# EasyEDA schematic EasyEDA_Schematic_V2.0.json
TITLE: Analog Safety Signal v2; REV: 1.0; Date: 2023-09-03; Sheet: 1/1; Drawn By: DJL19229
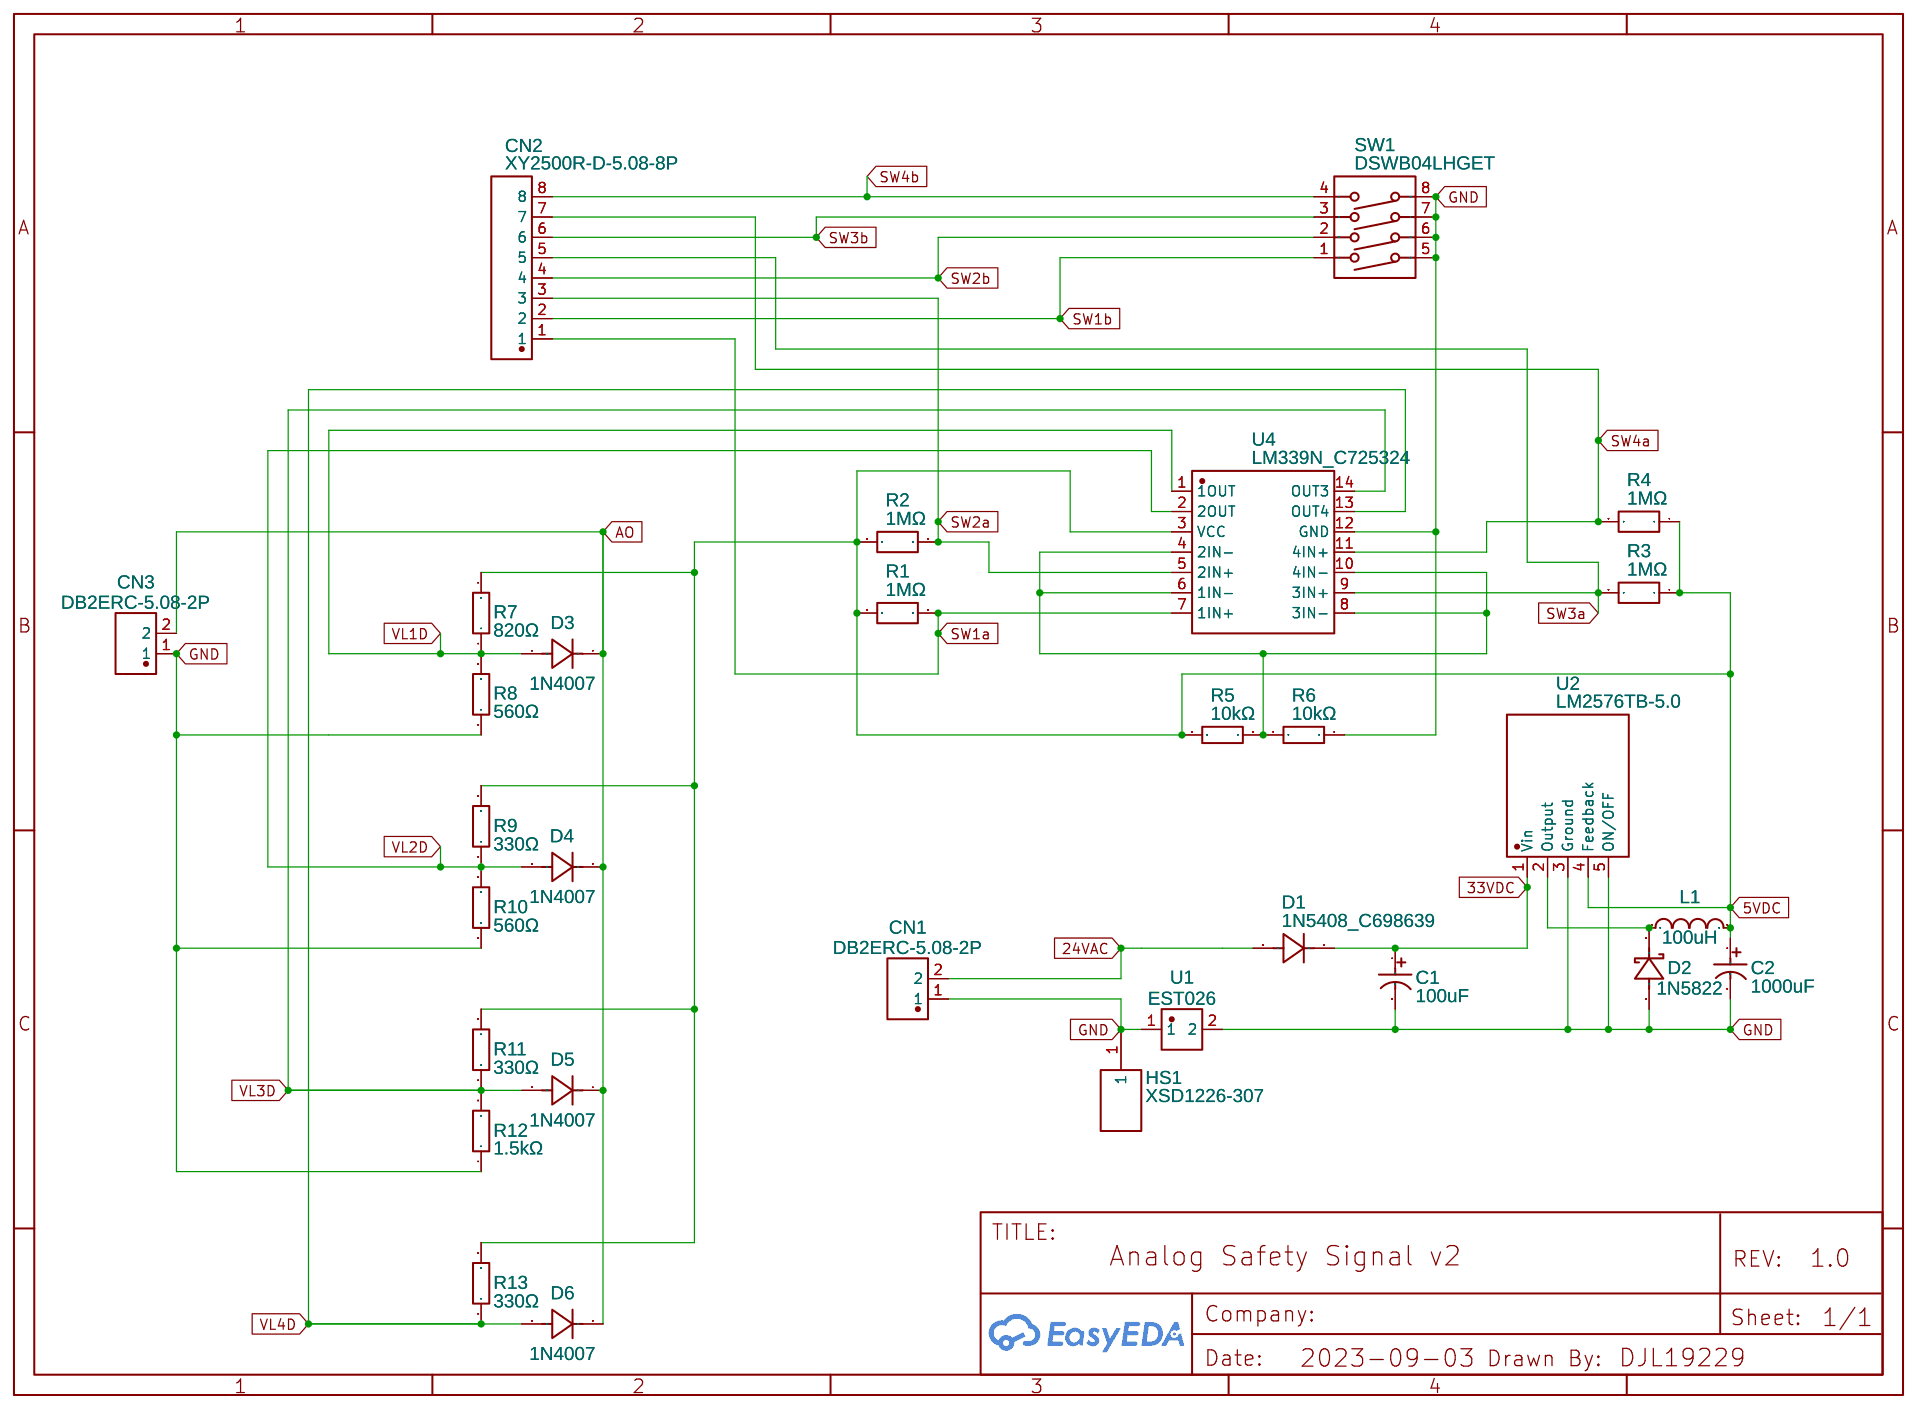
[diagram p0: schematic sheet]

## Parts
C1  100uF  [CAP-TH_BD8.0-P3.50-D0.6-FD]
C2  1000uF  [CAP-TH_BD13.0-P5.00-D1.2-FD]
CN1  DB2ERC-5.08-2P  [CONN-TH_2P-P5.08_DB2ERC-5.08-2P]
CN2  XY2500R-D-5.08-8P  [CONN-TH_8P-P5.08_XY2500R-D5.08-8P]
CN3  DB2ERC-5.08-2P  [CONN-TH_2P-P5.08_DB2ERC-5.08-2P]
D1  1N5408_C698639  [DO-201AD_BD5.3-L8.4-P12.50-D1.4-RD]
D2  1N5822  [DO-201AD_BD5.3-L8.4-P12.50-D1.4-FD]
D3  1N4007  [DO-41_BD2.4-L4.7-P8.70-D0.6-RD]
D4  1N4007  [DO-41_BD2.4-L4.7-P8.70-D0.6-RD]
D5  1N4007  [DO-41_BD2.4-L4.7-P8.70-D0.6-RD]
D6  1N4007  [DO-41_BD2.4-L4.7-P8.70-D0.6-RD]
HS1  XSD1226-307  [HEATSINK-TH_XSD1226-307]
L1  100uH  [IND-TH_BD10.0-P5.00-D0.7]
R1  1MΩ  [RES-TH_BD2.3-L6.5-P10.50-D0.5]
R2  1MΩ  [RES-TH_BD2.3-L6.5-P10.50-D0.5]
R3  1MΩ  [RES-TH_BD2.3-L6.5-P10.50-D0.5]
R4  1MΩ  [RES-TH_BD2.3-L6.5-P10.50-D0.5]
R5  10kΩ  [RES-TH_BD2.3-L6.5-P10.50-D0.5]
R6  10kΩ  [RES-TH_BD2.3-L6.5-P10.50-D0.5]
R7  820Ω  [RES-TH_BD2.2-L6.5-P10.50-D0.6]
R8  560Ω  [RES-TH_BD2.4-L6.3-P10.30-D0.6]
R9  330Ω  [RES-TH_BD2.4-L6.3-P10.30-D0.6]
R10  560Ω  [RES-TH_BD2.4-L6.3-P10.30-D0.6]
R11  330Ω  [RES-TH_BD2.4-L6.3-P10.30-D0.6]
R12  1.5kΩ  [RES-TH_BD2.3-L6.5-P10.50-D0.5]
R13  330Ω  [RES-TH_BD2.4-L6.3-P10.30-D0.6]
SW1  DSWB04LHGET  [SW-TH_DSWB04LHGET]
U1  EST026  [CONN-TH_L6.3-W0.8-EST026]
U2  LM2576TB-5.0  [TO-220-5_L10.2-W4.8-P1.70-TL]
U4  LM339N_C725324  [DIP-14_L19.0-W7.0-P2.54-LS7.6-BL]

## Library data of the parts
C1 = 100uF 50V 8*12Black high frequency: Supplier: LCSC; Manufacturer: CX(承兴); Manufacturer Part: GR107M050F12RR0VH4FP0; Supplier Part: C45102; JLCPCB Part Class: Extended Part
C2 = 35YXJ1000M12.5X20: Supplier: LCSC; Manufacturer: rubycon(红宝石); Supplier Part: C88743; JLCPCB Part Class: Extended Part
CN1 CN3 = DB2ERC-5.08-2P: Supplier: LCSC; Supplier Part: C395737; Manufacturer: DIBO(地博电气); Manufacturer Part: DB2ERC-5.08-2P-GN; Contributor: LCSC; JLCPCB Part Class: Extended Part
CN2 = XY2500R-D-5.08-8P: Contributor: LCSC; Supplier: LCSC; Supplier Part: C505830; Manufacturer: XINLAIYA(新莱亚); JLCPCB Part Class: Extended Part; link: https://lcsc.com/eda_search?q=C505830&%26type=1&ref=editor
D1 = 1N5408_C698639: Supplier: LCSC; Supplier Part: C698639; Manufacturer: YANGJIE(扬杰); Manufacturer Part: 1N5408; Contributor: LCSC; JLCPCB Part Class: Extended Part
D2 = 1N5822_C3018526: Supplier: LCSC; Supplier Part: C3018526; Manufacturer: FUXINSEMI(富芯森美); Contributor: lcsc; JLCPCB Part Class: Extended Part
D3-D6 = 1N4007_C2986225: Supplier: LCSC; Supplier Part: C2986225; Manufacturer: YANGJIE(扬杰); Contributor: lcsc; JLCPCB Part Class: Extended Part
HS1 = XSD1226-307: Supplier: LCSC; Supplier Part: C286232; Manufacturer: XSD(鑫顺达); Contributor: LCSC; JLCPCB Part Class: Extended Part
L1 = VLU0810-101K: Supplier: LCSC; Manufacturer: FH(风华); Supplier Part: C72630; JLCPCB Part Class: Extended Part
R1-R4 = MF1/4W-1MΩ±1%T52: Supplier: LCSC; Supplier Part: C714052; Manufacturer: Huaxing Mechanical-Elec.; Contributor: LCSC; JLCPCB Part Class: Extended Part
R5 R6 = MF1/4W-10KΩ±1% T52: Contributor: LCSC; Supplier: LCSC; Supplier Part: C119347; Manufacturer: CCO(千志电子); Manufacturer Part: MF1/4W-10KΩ±1% T; JLCPCB Part Class: Extended Part; link: https://lcsc.com/eda_search?q=C119347&%26type=1&ref=editor
R7 = MF1/4W ±1% 820Ω STB5: Contributor: LCSC; Supplier: LCSC; Supplier Part: C337186; Manufacturer: VO(翔胜); JLCPCB Part Class: Extended Part; link: https://lcsc.com/eda_search?q=C337186&%26type=1&ref=editor
R8 R10 = MFR-25FTE52-560R: Contributor: LCSC; Supplier: LCSC; Supplier Part: C173030; Manufacturer: YAGEO(国巨); JLCPCB Part Class: Extended Part; link: https://lcsc.com/eda_search?q=C173030&%26type=1&ref=editor
R9 R11 R13 = MFR-25JT-52-330R: Contributor: LCSC; Supplier: LCSC; Supplier Part: C176501; Manufacturer: YAGEO(国巨); JLCPCB Part Class: Extended Part; link: https://lcsc.com/eda_search?q=C176501&%26type=1&ref=editor
R12 = MF1/4W-1.5KΩ±1% T52: Contributor: LCSC; Supplier: LCSC; Supplier Part: C119328; Manufacturer: CCO(千志电子); Manufacturer Part: MF1/4W-1.5KΩ±1% T; JLCPCB Part Class: Extended Part; link: https://lcsc.com/eda_search?q=C119328&%26type=1&ref=editor
SW1 = DSWB04LHGET: Contributor: LCSC; Supplier: LCSC; Supplier Part: C99418; Manufacturer: YE; Manufacturer Part: 拨码开关,平拨开关,DSWB04LHGET; JLCPCB Part Class: Extended Part; link: https://lcsc.com/eda_search?q=C99418&%26type=1&ref=editor
U1 = EST026: Supplier: LCSC; Supplier Part: C52878; Manufacturer: xcfuse(旭程); JLCPCB Part Class: Extended Part; Contributor: LCSC
U2 = LM2576TB-5.0: Supplier: LCSC; Supplier Part: C5160073; Manufacturer: HGSEMI(华冠); link: https://atta.szlcsc.com/upload/public/pdf/source/20220920/BAE03355F1D658EA05EE543F8BD8FFC3.pdf; Contributor: lcsc
U4 = LM339N_C725324: Contributor: LCSC; Supplier: LCSC; Supplier Part: C725324; Manufacturer: HGSEMI; Manufacturer Part: LM339N; JLCPCB Part Class: Extended Part; link: https://lcsc.com/eda_search?q=C725324&%26type=1&ref=editor

## Nets
5VDC: C2.1 L1.2 R1.2 R2.2 R3.1 R4.1 R5.2 R7.2 R9.2 R11.2 R13.2 U2.4(Feedback) U4.3(VCC)
24VAC: CN1.2 D1.2(A)
33VDC: C1.1 D1.1(K) U2.1(Vin)
GND: C1.2 C2.2 CN1.1 CN3.1 D2.1(A) HS1.1 R6.1 R8.1 R10.1 R12.1 SW1.5 SW1.6 SW1.7 SW1.8 U1.1 U1.2 U2.3(Ground) U2.5(ON/OFF) U4.12(GND)
AO: CN3.2 D3.1(K) D4.1(K) D5.1(K) D6.1(K)
SW1a: CN2.1 R1.1 U4.7(1IN+)
SW1b: CN2.2 SW1.1
SW2a: CN2.3 R2.1 U4.5(2IN+)
SW2b: CN2.4 SW1.2
SW3a: CN2.5 R3.2 U4.9(3IN+)
SW3b: CN2.6 SW1.3
SW4a: CN2.7 R4.2 U4.11(4IN+)
SW4b: CN2.8 SW1.4
VL1D: D3.2(A) R7.1 R8.2 U4.1(1OUT)
VL2D: D4.2(A) R9.1 R10.2 U4.2(2OUT)
VL3D: D5.2(A) R11.1 R12.2 U4.14(OUT3)
VL4D: D6.2(A) R13.1 U4.13(OUT4)
Net-(D2-2): D2.2(K) L1.1 U2.2(Output)
Net-(R5-1): R5.1 R6.2 U4.4(2IN-) U4.6(1IN-) U4.8(3IN-) U4.10(4IN-)
